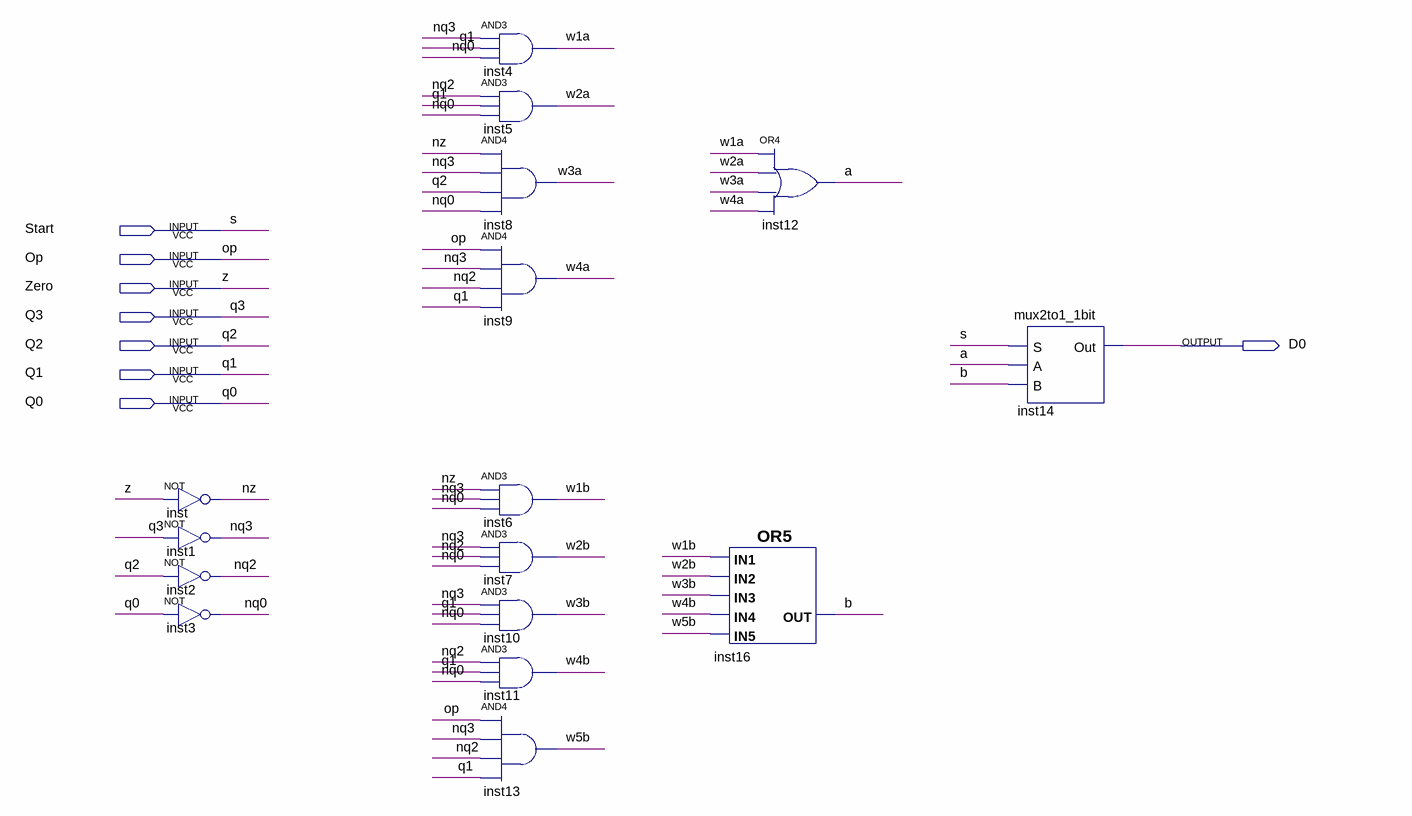
[diagram p0: schematic sheet]
// Quartus schematic D0.bdf as structural Verilog: 16 symbols, 8 pins
module D0 (
  input  Start,
  input  Op,
  input  Zero,
  input  Q3,
  input  Q2,
  input  Q1,
  input  Q0,
  output D0
);

  wire a, b, nq0, nq2, nq3, nz, w1a, w1b, w2a, w2b, w3a, w3b, w4a, w4b, w5b;

  not inst (nz, Zero);
  not inst1 (nq3, Q3);
  not inst2 (nq2, Q2);
  not inst3 (nq0, Q0);
  and inst4 (w1a, nq3, Q1, nq0);
  and inst5 (w2a, nq2, Q1, nq0);
  and inst8 (w3a, nz, nq3, Q2, nq0);
  and inst9 (w4a, Op, nq3, nq2, Q1);
  and inst6 (w1b, nz, nq3, nq0);
  and inst7 (w2b, nq3, nq2, nq0);
  and inst10 (w3b, nq3, Q1, nq0);
  and inst11 (w4b, nq2, Q1, nq0);
  and inst13 (w5b, Op, nq3, nq2, Q1);
  or inst12 (a, w1a, w2a, w3a, w4a);
  or inst16 (b, w1b, w2b, w3b, w4b, w5b);
  mux2to1_1bit inst14 (.S(Start), .A(a), .B(b), .Out(D0));

  // Other names for the same wires on the sheet: s = Start; z = Zero
endmodule
